# Altium schematic sheet SIGNAL1.SchDoc
size A3
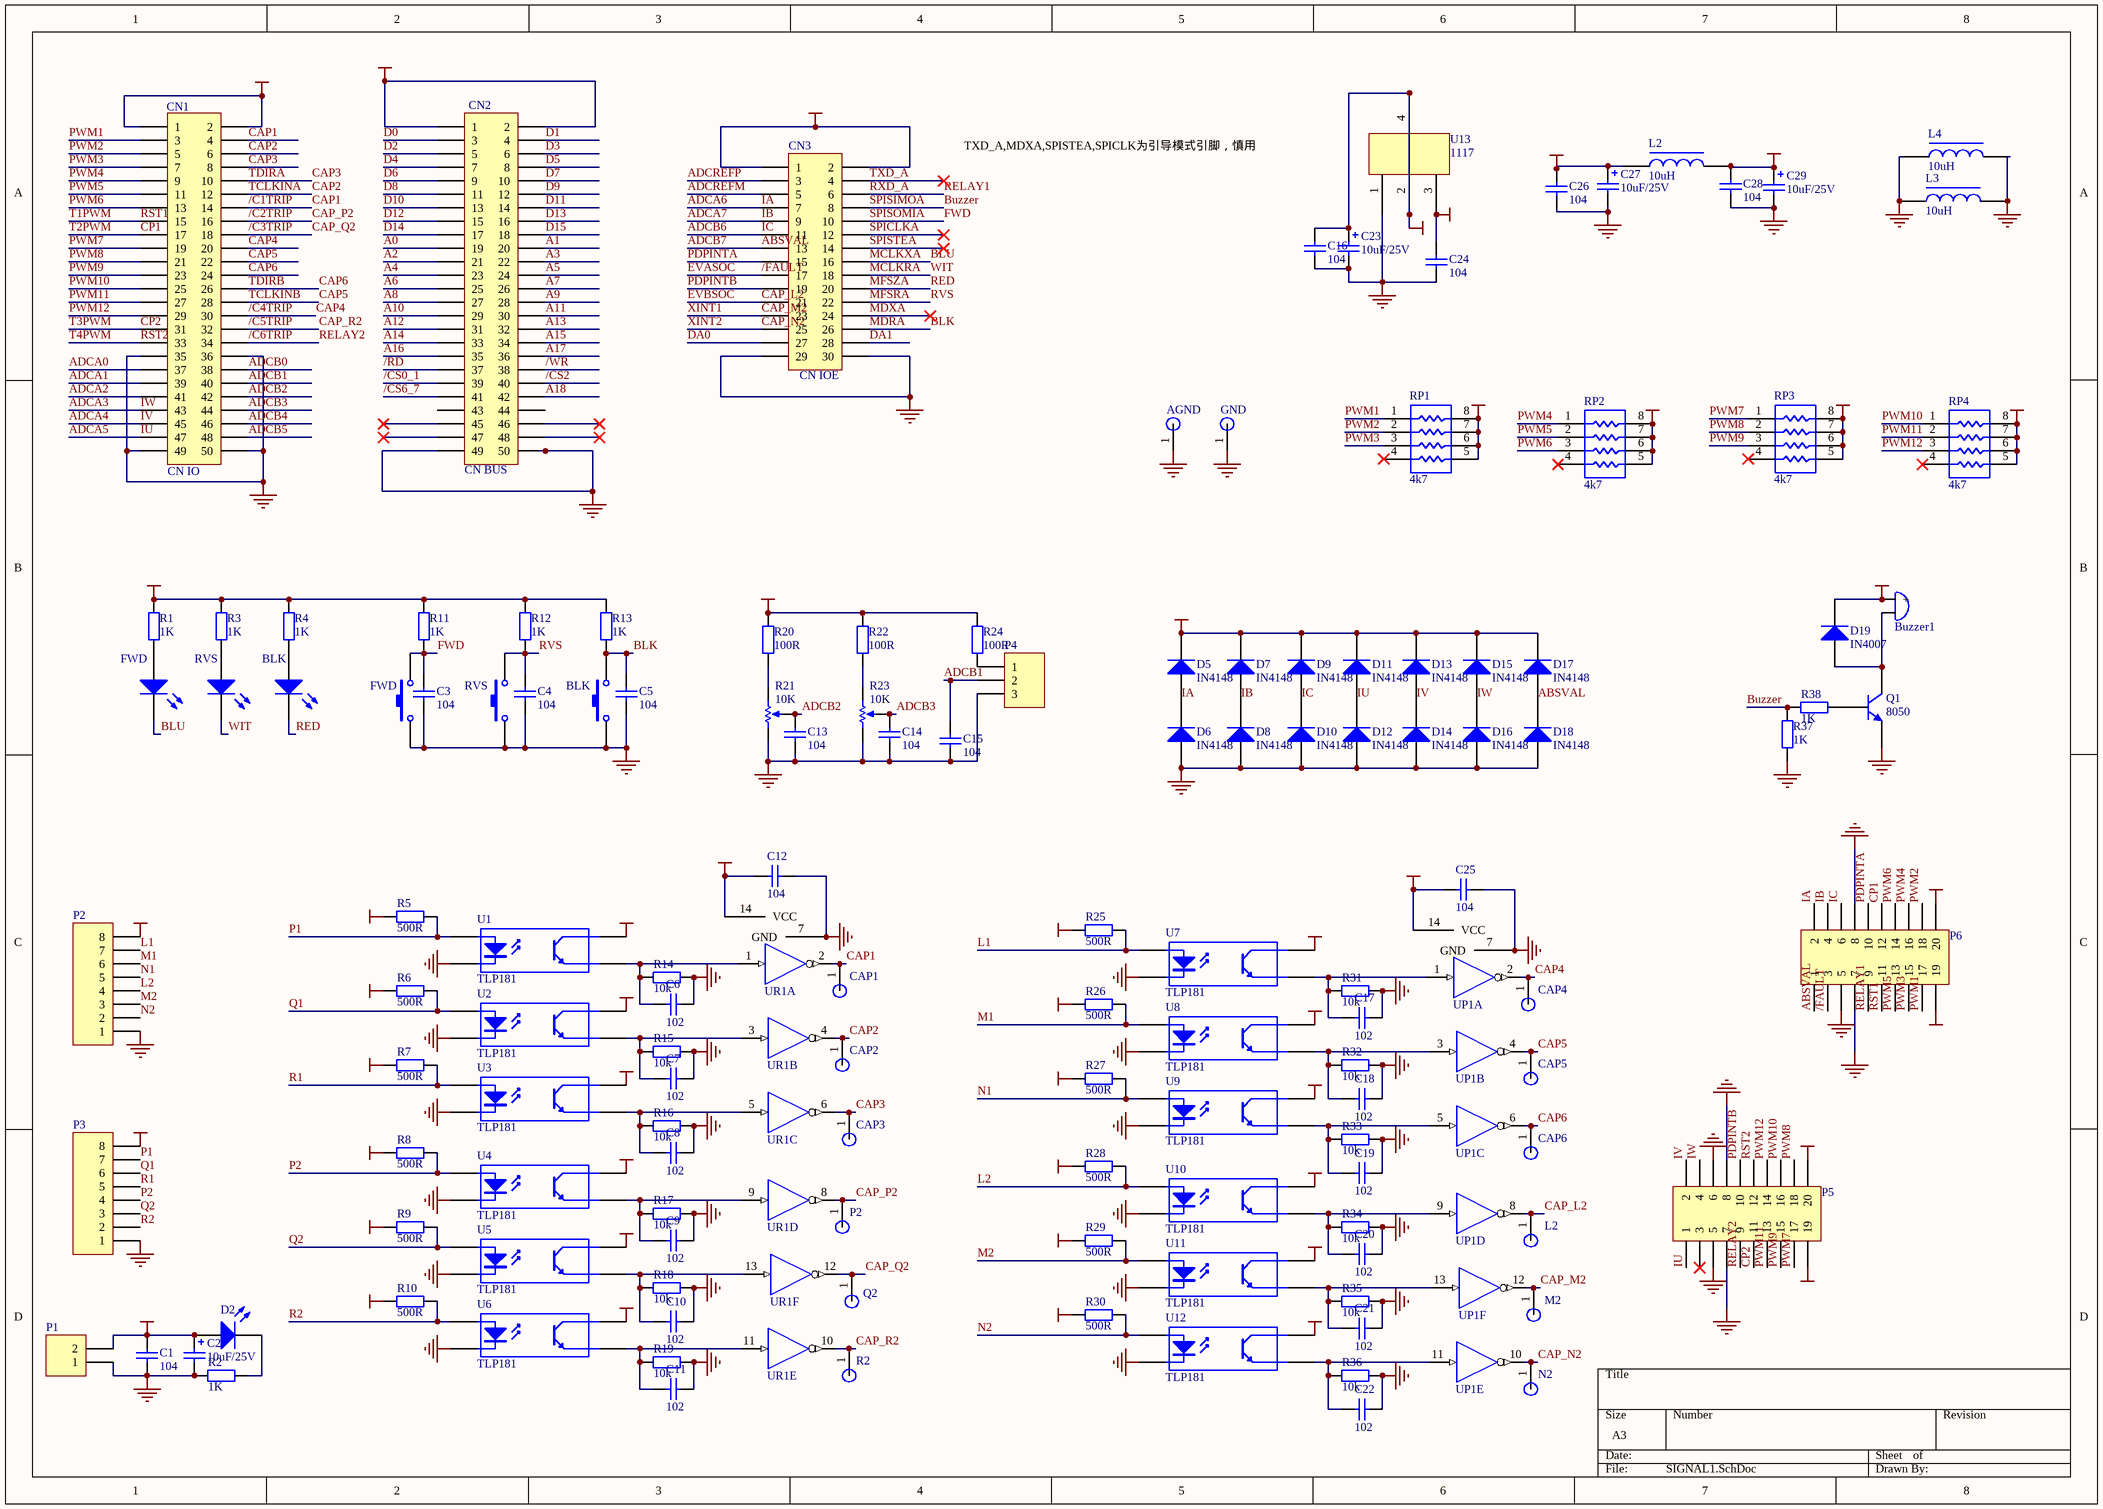
[diagram p0: SIGNAL1.SchDoc]

## Parts
Buzzer1  BUZZER  [Buzzer]  (value not drawn)
C1  104  [C2012-0805]
C2  10uF/25V  [C_10UF/25V]
C3  104  [C2012-0805]
C4  104  [C2012-0805]
C5  104  [C2012-0805]
C6  102  [C2012-0805]
C7  102  [C2012-0805]
C8  102  [C2012-0805]
C9  102  [C2012-0805]
C10  102  [C2012-0805]
C11  102  [C2012-0805]
C12  104  [C2012-0805]
C13  104  [C2012-0805]
C14  104  [C2012-0805]
C15  104  [C2012-0805]
C16  104  [C2012-0805]
C17  102  [C2012-0805]
C18  102  [C2012-0805]
C19  102  [C2012-0805]
C20  102  [C2012-0805]
C21  102  [C2012-0805]
C22  102  [C2012-0805]
C23  10uF/25V  [C_10UF/25V]
C24  104  [C2012-0805]
C25  104  [C2012-0805]
C26  104  [C2012-0805]
C27  10uF/25V  [C_10UF/25V]
C28  104  [C2012-0805]
C29  10uF/25V  [C_10UF/25V]
CN1  CN IO  [HDR2X25]
CN2  CN BUS  [HDR2X25]
CN3  CN IOE  [HDR2X15]
D1  FWD  [LED-SMD]
D2  (no value)  [LED-SMD]
D3  RVS  [LED-SMD]
D4  BLK  [LED-SMD]
D5  IN4148  [IN4148]
D6  IN4148  [IN4148]
D7  IN4148  [IN4148]
D8  IN4148  [IN4148]
D9  IN4148  [IN4148]
D10  IN4148  [IN4148]
D11  IN4148  [IN4148]
D12  IN4148  [IN4148]
D13  IN4148  [IN4148]
D14  IN4148  [IN4148]
D15  IN4148  [IN4148]
D16  IN4148  [IN4148]
D17  IN4148  [IN4148]
D18  IN4148  [IN4148]
D19  IN4007  [DIODE4007]
key1  FWD  [KEY1]
key2  RVS  [KEY1]
key3  BLK  [KEY1]
L2  10uH  [R2012-0805]
L3  10uH  [R2012-0805]
L4  10uH  [R2012-0805]
P1  Header 2  [HDR1X2]  (value not drawn)
P2  Header 8  [HDR1X8]  (value not drawn)
P3  Header 8  [HDR1X8]  (value not drawn)
P4  Header 3  [HDR1X3]  (value not drawn)
P5  Header 10X2  [HDR2X10]  (value not drawn)
P6  Header 10X2  [HDR2X10]  (value not drawn)
Q1  8050  [NPN8050]
R1  1K  [R2012-0805]
R2  1K  [R2012-0805]
R3  1K  [R2012-0805]
R4  1K  [R2012-0805]
R5  500R  [R2012-0805]
R6  500R  [R2012-0805]
R7  500R  [R2012-0805]
R8  500R  [R2012-0805]
R9  500R  [R2012-0805]
R10  500R  [R2012-0805]
R11  1K  [R2012-0805]
R12  1K  [R2012-0805]
R13  1K  [R2012-0805]
R14  10k  [R2012-0805]
R15  10k  [R2012-0805]
R16  10k  [R2012-0805]
R17  10k  [R2012-0805]
R18  10k  [R2012-0805]
R19  10k  [R2012-0805]
R20  100R  [R2012-0805]
R21  10K  [Res3296]
R22  100R  [R2012-0805]
R23  10K  [Res3296]
R24  100R  [R2012-0805]
R25  500R  [R2012-0805]
R26  500R  [R2012-0805]
R27  500R  [R2012-0805]
R28  500R  [R2012-0805]
R29  500R  [R2012-0805]
R30  500R  [R2012-0805]
R31  10k  [R2012-0805]
R32  10k  [R2012-0805]
R33  10k  [R2012-0805]
R34  10k  [R2012-0805]
R35  10k  [R2012-0805]
R36  10k  [R2012-0805]
R37  1K  [R2012-0805]
R38  1K  [R2012-0805]
RP1  4k7  [Res_Pack4]
RP2  4k7  [Res_Pack4]
RP3  4k7  [Res_Pack4]
RP4  4k7  [Res_Pack4]
T1  CAP1  [PIN1]
T2  CAP2  [PIN1]
T3  P2  [PIN1]
T4  CAP3  [PIN1]
T5  R2  [PIN1]
T6  Q2  [PIN1]
T7  AGND  [PIN1]
T8  GND  [PIN1]
T9  CAP4  [PIN1]
T10  CAP5  [PIN1]
T11  CAP6  [PIN1]
T12  L2  [PIN1]
T13  N2  [PIN1]
T14  M2  [PIN1]
U1  TLP181  [TLP181]
U2  TLP181  [TLP181]
U3  TLP181  [TLP181]
U4  TLP181  [TLP181]
U5  TLP181  [TLP181]
U6  TLP181  [TLP181]
U7  TLP181  [TLP181]
U8  TLP181  [TLP181]
U9  TLP181  [TLP181]
U10  TLP181  [TLP181]
U11  TLP181  [TLP181]
U12  TLP181  [TLP181]
U13  1117  [1117-3.3V]
UP1  74HC14  [74HC14]  (value not drawn)  (parts A,B,C,D,E,F of 6)
UR1  74HC14  [74HC14]  (value not drawn)  (parts A,B,C,D,E,F of 6)

## Nets
3.3_OPT: C12.2 C16.2 C23.1 C25.2 D5.2(K) D7.2(K) D9.2(K) D11.2(K) D13.2(K) D15.2(K) D17.2(K) R1.2 R3.2 R4.2 R11.2 R12.2 R13.2 R20.2 R22.2 R24.2 RP1.5 RP1.6 RP1.7 RP1.8 RP2.5 RP2.6 RP2.7 RP2.8 RP3.5 RP3.6 RP3.7 RP3.8 RP4.5 RP4.6 RP4.7 RP4.8 U1.6(C) U2.6(C) U3.6(C) U4.6(C) U5.6(C) U6.6(C) U7.6(C) U8.6(C) U9.6(C) U10.6(C) U11.6(C) U12.6(C) U13.2 U13.4 UP1.14(VCC) UR1.14(VCC)
+5V: Buzzer1.1(+) C26.2 C27.1 CN1.1 CN1.2 CN2.1 CN2.2 CN3.1 CN3.2 D19.2(K) L2.1 P5.19 P5.20 P6.19 P6.20
+5V_HALL: C1.2 C2.1 D2.1(A) P1.2 P2.8 P3.8 R5.1 R6.1 R7.1 R8.1 R9.1 R10.1 R25.1 R26.1 R27.1 R28.1 R29.1 R30.1
A+5V: C24.2 C28.2 C29.1 L2.2 U13.3
AGND: C13.1 C14.1 C15.1 C28.1 C29.2 D6.1(A) D8.1(A) D10.1(A) D12.1(A) D14.1(A) D16.1(A) D18.1(A) L3.1 L4.1 P4.3 P5.5 P5.6 P6.5 R21.1(TOP) R23.1(TOP) T7.1(A)
GND: C3.1 C4.1 C5.1 C6.1 C7.1 C8.1 C9.1 C10.1 C11.1 C12.1 C16.1 C17.1 C18.1 C19.1 C20.1 C21.1 C22.1 C23.2 C24.1 C25.1 C26.1 C27.2 CN1.35 CN1.36 CN1.49 CN1.50 CN2.49 CN2.50 CN3.29 CN3.30 key1.1 key2.1 key3.1 L3.2 L4.2 P5.7 P5.8 P6.7 P6.8 Q1.2(E) R14.2 R15.2 R16.2 R17.2 R18.2 R19.2 R31.2 R32.2 R33.2 R34.2 R35.2 R36.2 R37.2 T8.1(A) U13.1 UP1.7(GND) UR1.7(GND)
GND_HALL: C1.1 C2.2 P1.1 P2.1 P3.1 R2.1 U1.3(K) U2.3(K) U3.3(K) U4.3(K) U5.3(K) U6.3(K) U7.3(K) U8.3(K) U9.3(K) U10.3(K) U11.3(K) U12.3(K)
/C1TRIP: CN1.4 CN1.14 T1.1(A) UR1.2(Y)  [also labelled CAP1]
/C2TRIP: CN1.16 T3.1(A) UR1.8(Y)  [also labelled CAP_P2]
/C3TRIP: CN1.18 T6.1(A) UR1.12(Y)  [also labelled CAP_Q2]
/C4TRIP: CN1.20 CN1.30 T9.1(A) UP1.2(Y)  [also labelled CAP4]
/C5TRIP: CN1.32 T5.1(A) UR1.10(Y)  [also labelled CAP_R2]
/C6TRIP: CN1.34 P5.9  [also labelled RELAY2]
/CS0_1: CN2.39
/CS2: CN2.40
/CS6_7: CN2.41
/FAULT: CN3.17 P6.3  [also labelled EVASOC]
/RD: CN2.37
/WR: CN2.38
A0: CN2.19
A1: CN2.20
A2: CN2.21
A3: CN2.22
A4: CN2.23
A5: CN2.24
A6: CN2.25
A7: CN2.26
A8: CN2.27
A9: CN2.28
A10: CN2.29
A11: CN2.30
A12: CN2.31
A13: CN2.32
A14: CN2.33
A15: CN2.34
A16: CN2.35
A17: CN2.36
A18: CN2.42
ABSVAL: CN3.13 D17.1(A) D18.2(K) P6.1  [also labelled ADCB7]
ADCA0: CN1.37
ADCA1: CN1.39
ADCA2: CN1.41
ADCA3: CN1.43 D15.1(A) D16.2(K) P5.4  [also labelled IW]
ADCA4: CN1.45 D13.1(A) D14.2(K) P5.2  [also labelled IV]
ADCA5: CN1.47 D11.1(A) D12.2(K) P5.1  [also labelled IU]
ADCA6: CN3.7 D5.1(A) D6.2(K) P6.2  [also labelled IA]
ADCA7: CN3.9 D7.1(A) D8.2(K) P6.4  [also labelled IB]
ADCB0: CN1.38
ADCB1: C15.2 CN1.40 P4.2
ADCB2: C13.2 CN1.42 R21.2(TAP)
ADCB3: C14.2 CN1.44 R23.2(TAP)
ADCB4: CN1.46
ADCB5: CN1.48
ADCB6: CN3.11 D9.1(A) D10.2(K) P6.6  [also labelled IC]
ADCREFM: CN3.5
ADCREFP: CN3.3
BLK: C5.2 CN3.26 key3.3 R13.1  [also labelled MDRA]
BLU: CN3.16 D1.2(K)  [also labelled MCLKXA]
Buzzer: CN3.8 R37.1 R38.2  [also labelled SPISIMOA]
CAP2: CN1.6 CN1.12 T2.1(A) UR1.4(Y)  [also labelled TCLKINA]
CAP3: CN1.8 CN1.10 T4.1(A) UR1.6(Y)  [also labelled TDIRA]
CAP5: CN1.22 CN1.28 T10.1(A) UP1.4(Y)  [also labelled TCLKINB]
CAP6: CN1.24 CN1.26 T11.1(A) UP1.6(Y)  [also labelled TDIRB]
CAP_L2: CN3.21 T12.1(A) UP1.8(Y)  [also labelled EVBSOC]
CAP_M2: CN3.23 T14.1(A) UP1.12(Y)  [also labelled XINT1]
CAP_N2: CN3.25 T13.1(A) UP1.10(Y)  [also labelled XINT2]
CP1: CN1.17 P6.12  [also labelled T2PWM]
CP2: CN1.31 P5.11  [also labelled T3PWM]
D0: CN2.3
D1: CN2.4
D2: CN2.5
D3: CN2.6
D4: CN2.7
D5: CN2.8
D6: CN2.9
D7: CN2.10
D8: CN2.11
D9: CN2.12
D10: CN2.13
D11: CN2.14
D12: CN2.15
D13: CN2.16
D14: CN2.17
D15: CN2.18
DA0: CN3.27
DA1: CN3.28
FWD: C3.2 CN3.10 key1.3 R11.1  [also labelled SPISOMIA]
L1: P2.7 R25.2 U7.1(A)
L2: P2.4 R28.2 U10.1(A)
M1: P2.6 R26.2 U8.1(A)
M2: P2.3 R29.2 U11.1(A)
MCLKRA: CN3.18 D3.2(K)  [also labelled WIT]
MDXA: CN3.24
MFSRA: C4.2 CN3.22 key2.3 R12.1  [also labelled RVS]
MFSZA: CN3.20 D4.2(K)  [also labelled RED]
N1: P2.5 R27.2 U9.1(A)
N2: P2.2 R30.2 U12.1(A)
P1: P3.7 R5.2 U1.1(A)
P2: P3.4 R8.2 U4.1(A)
PDPINTA: CN3.15 P6.10
PDPINTB: CN3.19 P5.10
PWM1: CN1.3 P6.17 RP1.1
PWM2: CN1.5 P6.18 RP1.2
PWM3: CN1.7 P6.15 RP1.3
PWM4: CN1.9 P6.16 RP2.1
PWM5: CN1.11 P6.13 RP2.2
PWM6: CN1.13 P6.14 RP2.3
PWM7: CN1.19 P5.17 RP3.1
PWM8: CN1.21 P5.18 RP3.2
PWM9: CN1.23 P5.15 RP3.3
PWM10: CN1.25 P5.16 RP4.1
PWM11: CN1.27 P5.13 RP4.2
PWM12: CN1.29 P5.14 RP4.3
Q1: P3.6 R6.2 U2.1(A)
Q2: P3.3 R9.2 U5.1(A)
R1: P3.5 R7.2 U3.1(A)
R2: P3.2 R10.2 U6.1(A)
RELAY1: CN3.6 P6.9  [also labelled RXD_A]
RST1: CN1.15 P6.11  [also labelled T1PWM]
RST2: CN1.33 P5.12  [also labelled T4PWM]
SPICLKA: CN3.12
SPISTEA: CN3.14
TXD_A: CN3.4
NetBuzzer1_2: Buzzer1.2(-) D19.1(A) Q1.3(C)
NetC6_2: C6.2 R14.1 U1.4(E) UR1.1(A)
NetC7_2: C7.2 R15.1 U2.4(E) UR1.3(A)
NetC8_2: C8.2 R16.1 U3.4(E) UR1.5(A)
NetC9_2: C9.2 R17.1 U4.4(E) UR1.9(A)
NetC10_2: C10.2 R18.1 U5.4(E) UR1.13(A)
NetC11_2: C11.2 R19.1 U6.4(E) UR1.11(A)
NetC17_2: C17.2 R31.1 U7.4(E) UP1.1(A)
NetC18_2: C18.2 R32.1 U8.4(E) UP1.3(A)
NetC19_2: C19.2 R33.1 U9.4(E) UP1.5(A)
NetC20_2: C20.2 R34.1 U10.4(E) UP1.9(A)
NetC21_2: C21.2 R35.1 U11.4(E) UP1.13(A)
NetC22_2: C22.2 R36.1 U12.4(E) UP1.11(A)
NetD1_1: D1.1(A) R1.1
NetD2_2: D2.2(K) R2.2
NetD3_1: D3.1(A) R3.1
NetD4_1: D4.1(A) R4.1
NetP4_1: P4.1 R24.1
NetQ1_1: Q1.1(B) R38.1
NetR20_1: R20.1 R21.3(BOT)
NetR22_1: R22.1 R23.3(BOT)

Not connected (* = marked no-connect by the designer): CN2 43 44 45* 46* 47* 48*; P5 3*; RP1 4*; RP2 4*; RP3 4*; RP4 4*

## Notes on the sheet
- TXD_A,MDXA,SPISTEA,SPICLK为引导模式引脚，慎用

## Library data of the parts
Buzzer1 = BUZZER: 蜂鸣器
C1 C3-C22 C24-C26 C28 = Cap: 普通电容
  C1 C3-C5 C12-C16 C24-C26 C28: Value: 104
  C6-C11 C17-C22: Value: 102
C2 C23 C27 C29 = Cap tan: 钽电解; value: 10uF/25V
CN1 CN2 = Header 25X2: Header, 25-Pin, Dual row; LatestRevisionDate: 17-Jul-2002; LatestRevisionNote: Re-released for DXP Platform.; Publisher: Altium Limited
CN3 = Header 15X2: Header, 15-Pin, Dual row; LatestRevisionDate: 17-Jul-2002; LatestRevisionNote: Re-released for DXP Platform.; Publisher: Altium Limited
D1-D4 = LED
D5-D18 = Diode IN4148: 开关二极管
D19 = Diode IN4007: 普通整流二极管; value: IN4007
key1-key3 = KEY: 按键
L2-L4 = Inductor: Value: 10uH
P1 = Header 2: Header, 2-Pin; LatestRevisionDate: 17-Jul-2002; LatestRevisionNote: Re-released for DXP Platform.; Publisher: Altium Limited
P2 P3 = Header 8: Header, 8-Pin; LatestRevisionDate: 17-Jul-2002; LatestRevisionNote: Re-released for DXP Platform.; Publisher: Altium Limited
P4 = Header 3: Header, 3-Pin; LatestRevisionDate: 17-Jul-2002; LatestRevisionNote: Re-released for DXP Platform.; Publisher: Altium Limited
P5 P6 = Header 10X2: Header, 10-Pin, Dual row; LatestRevisionDate: 17-Jul-2002; LatestRevisionNote: Re-released for DXP Platform.; Publisher: Altium Limited
Q1 = NPN8050
R1-R20 R22 R24-R38 = Res
  R1-R4 R11-R13 R37 R38: Value: 1K
  R20 R22 R24: Value: 100R
R21 R23 = Res3296: 微调电位器; value: 10K
RP1-RP4 = Res_Pack4: value: 4k7
T1-T14 = TP: 测试脚
UP1 UR1 = 74HC14: 六路，施密特触发反相器